# EAGLE design Adapter Custom (EAGLE 8.2.2)
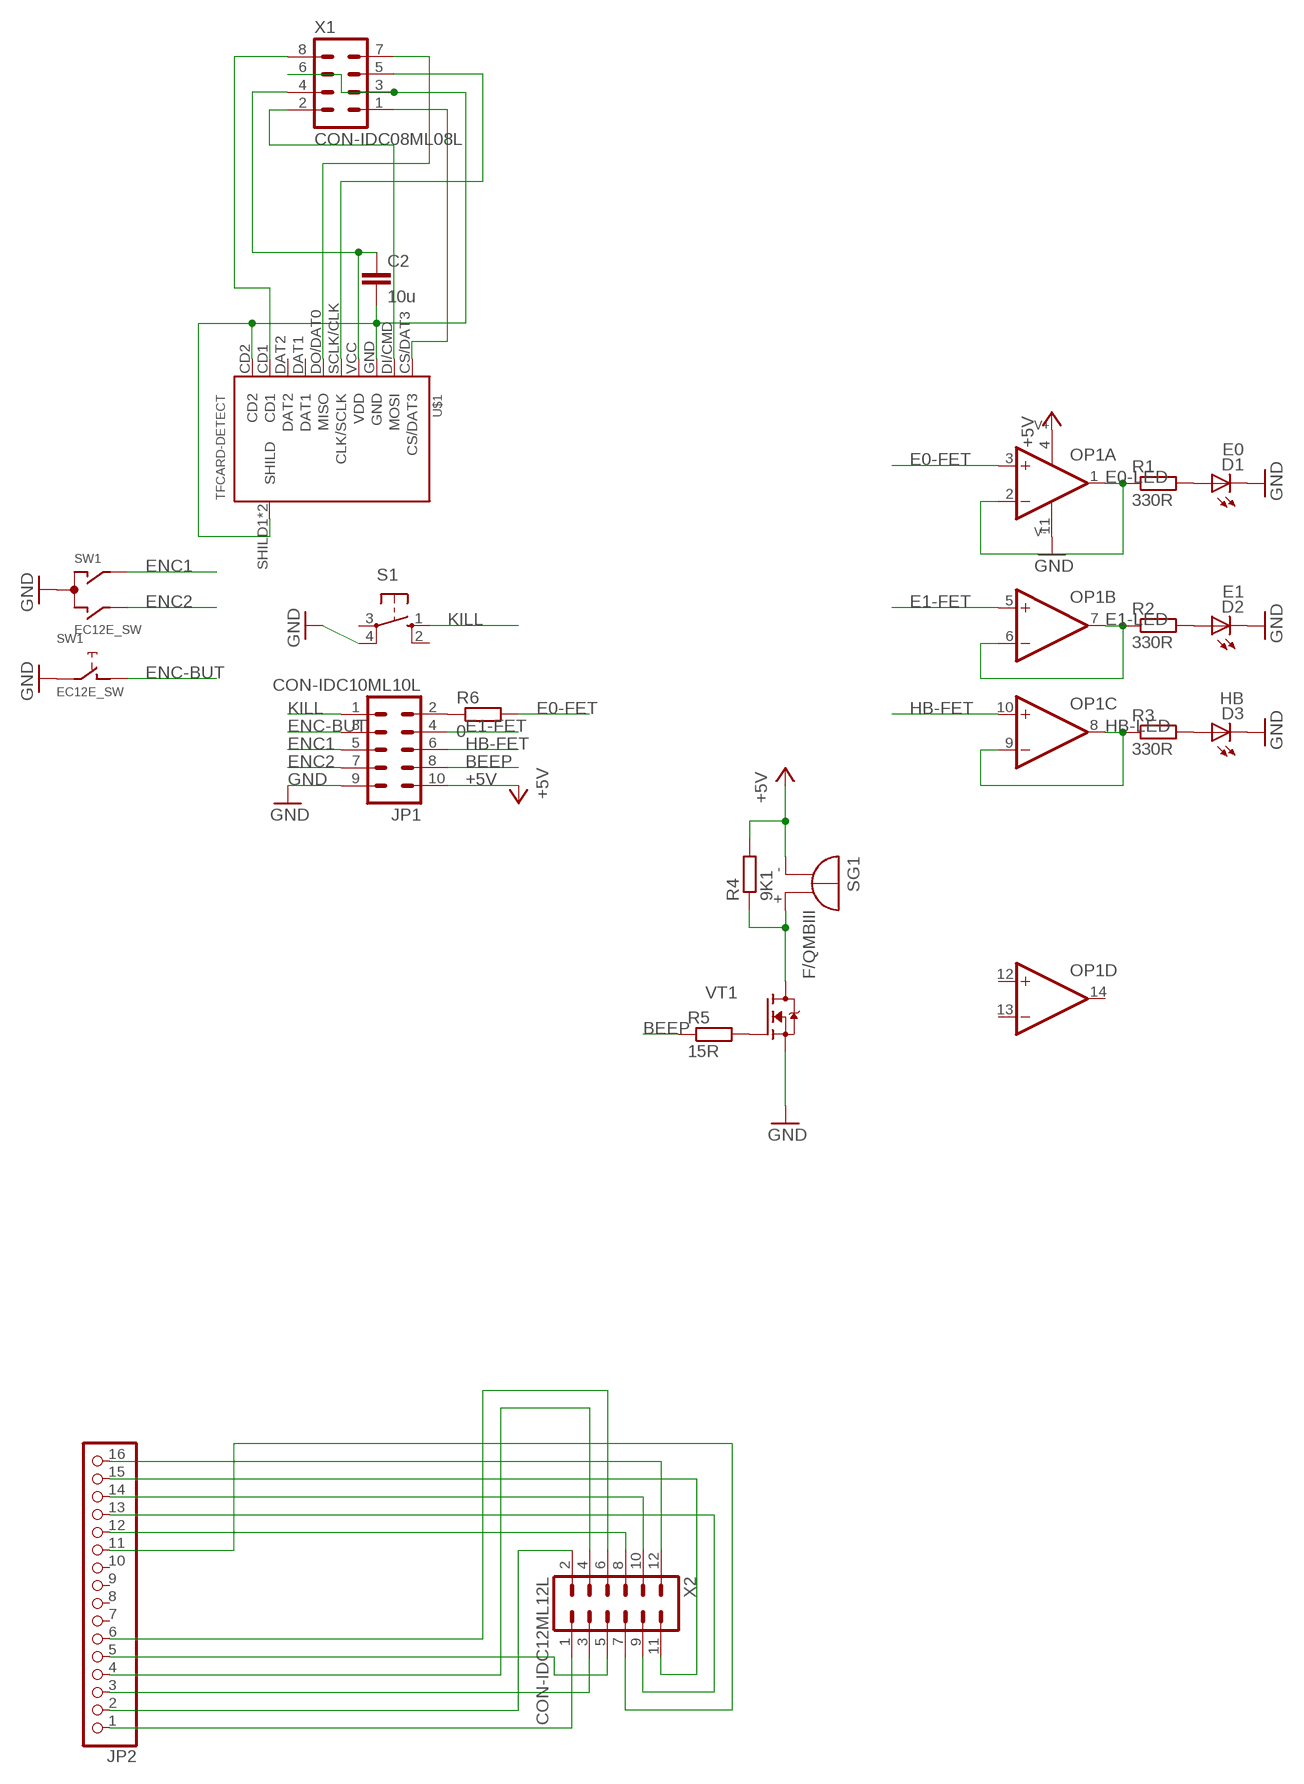
[diagram p0: schematic, sheet 1]

## Parts
C2  10u  CAP_0805  [C0805]
D1  E0  LED_3MM  [LED3MM]
D2  E1  LED_3MM  [LED3MM]
D3  HB  LED_3MM  [LED3MM]
JP1  CON-IDC10ML10L  [ML10L]
JP2  PINHD-1X16  [1X16]
OP1  OP-AMP-4LMV324IPT  [TSSOP14]
R1  330R  R_0805  [R0805]
R2  330R  R_0805  [R0805]
R3  330R  R_0805  [R0805]
R4  9K1  R_0805  [R0805]
R5  15R  R_0805  [R0805]
R6  0  R_0805  [R0805]
S1  40-XX  [B3F-40XX]
SG1  F/QMBIII  [F/QMBIII]
SW1  EC12E_SW  [ALPS_EC12E_SW]
U$1  TFCARD-DETECT  [ST-TF-DETECT]
VT1  FET-NSOT-23  [SOT23]
X1  CON-IDC08ML08L  [ML08L]
X2  CON-IDC12ML12L  [ML12L]

## Nets
+5V: JP1.10 OP1.4(PW:V+) R4.2 SG1.-(+)
BEEP: JP1.8 R5.1
E0-FET: OP1.3(A:+IN) R6.2
E0-LED: OP1.1(A:OUT) OP1.2(A:-IN) R1.1
E1-FET: JP1.4 OP1.5(B:+IN)
E1-LED: OP1.6(B:-IN) OP1.7(B:OUT) R2.1
ENC1: JP1.5 SW1.A
ENC2: JP1.7 SW1.B
ENC-BUT: JP1.3 SW1.D
GND: D1.K(C) D2.K(C) D3.K(C) JP1.9 OP1.11(PW:V-) S1.4(P1) SW1.C SW1.E VT1.2(S)
HB-FET: JP1.6 OP1.10(C:+IN)
HB-LED: OP1.8(C:OUT) OP1.9(C:-IN) R3.1
KILL: JP1.1 S1.1(S)
N$2: D1.A R1.2
N$3: D2.A R2.2
N$4: D3.A R3.2
N$5: R5.2 VT1.1(G)
N$6: R4.1 SG1.+(-) VT1.3(D)
N$7: JP1.2 R6.1
N$8: C2.2 U$1.CD2 U$1.GND U$1.SHILD1(SHILD) U$1.SHILD2(SHILD) X1.3 X1.6
N$9: C2.1 U$1.VCC(VDD) X1.4
N$10: U$1.CS/DAT3 X1.1
N$11: U$1.DI/CMD(MOSI) X1.2
N$12: JP2.16 X2.12
N$13: JP2.15 X2.11
N$14: U$1.SCLK/CLK(CLK/SCLK) X1.5
N$15: JP2.14 X2.10
N$16: U$1.DO/DAT0(MISO) X1.7
N$17: JP2.12 X2.8
N$18: JP2.13 X2.9
N$19: JP2.11 X2.7
N$20: JP2.1 X2.1
N$21: JP2.2 X2.2
N$22: JP2.3 X2.3
N$23: JP2.5 X2.5
N$24: JP2.4 X2.4
N$25: JP2.6 X2.6
N$27: U$1.CD1 X1.8
Unconnected: JP2.7 JP2.8 JP2.9 JP2.10 OP1.12(D:+IN) OP1.13(D:-IN) OP1.14(D:OUT) S1.2(S1) S1.3(P) SW1.GND1(G) SW1.GND2(G) U$1.DAT1 U$1.DAT2

## Library data of the parts
C2 = Namenlos:CAP_
D1-D3 = Namenlos:LED_
JP1 = Namenlos:CON-IDC10: HARTING; OC_FARNELL: unknown; OC_NEWARK: unknown
JP2 = pinhead:PINHD-1X16: PIN HEADER
OP1 = Namenlos:OP-AMP-4
R1-R6 = Namenlos:R_
S1 = switch-omron:40-XX: OMRON SWITCH; MF: OMRON COMPONENTS USA; MPN: B3F-4000; OC_FARNELL: 176434; OC_NEWARK: 36K3105
SG1 = buzzer:F/QMBIII: BUZZER Source: Buerklin; OC_FARNELL: unknown; OC_NEWARK: unknown
SW1 = switch-alps:EC12E_SW: ALPS rotary Encoder EC12E series with switch; MPN: EC12E2424407; OC_FARNELL: 1520813; OC_NEWARK: 74M1068
U$1 = Namenlos:TFCARD-DETECT
VT1 = Namenlos:FET-N
X1 = Namenlos:CON-IDC08
X2 = Namenlos:CON-IDC12

## Board
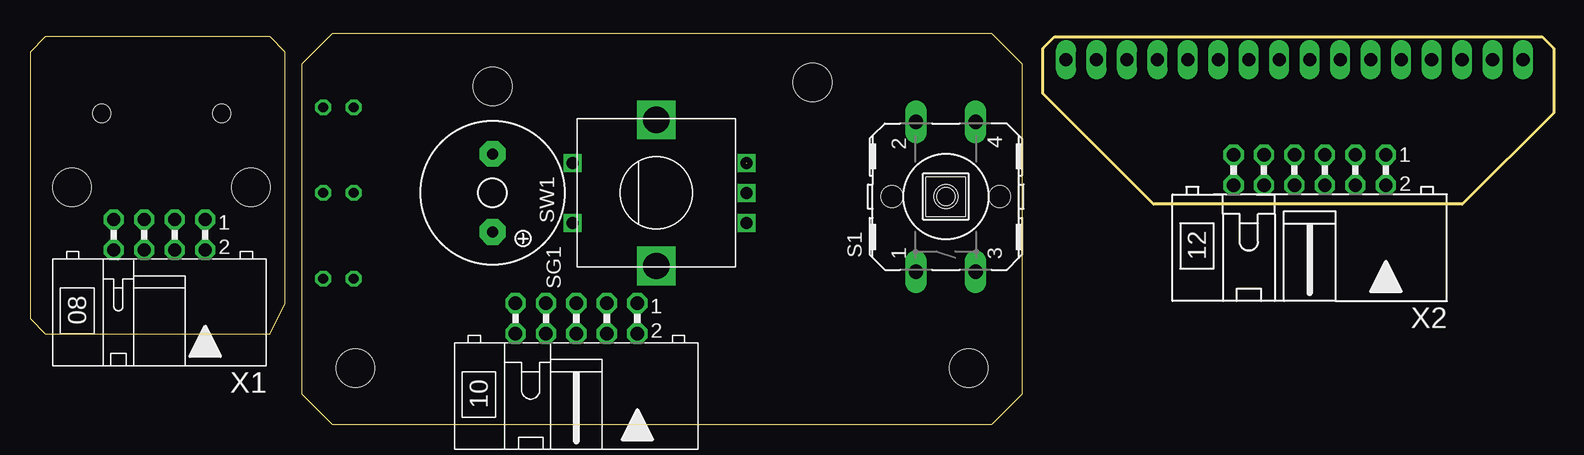
[diagram p1: board, top side]
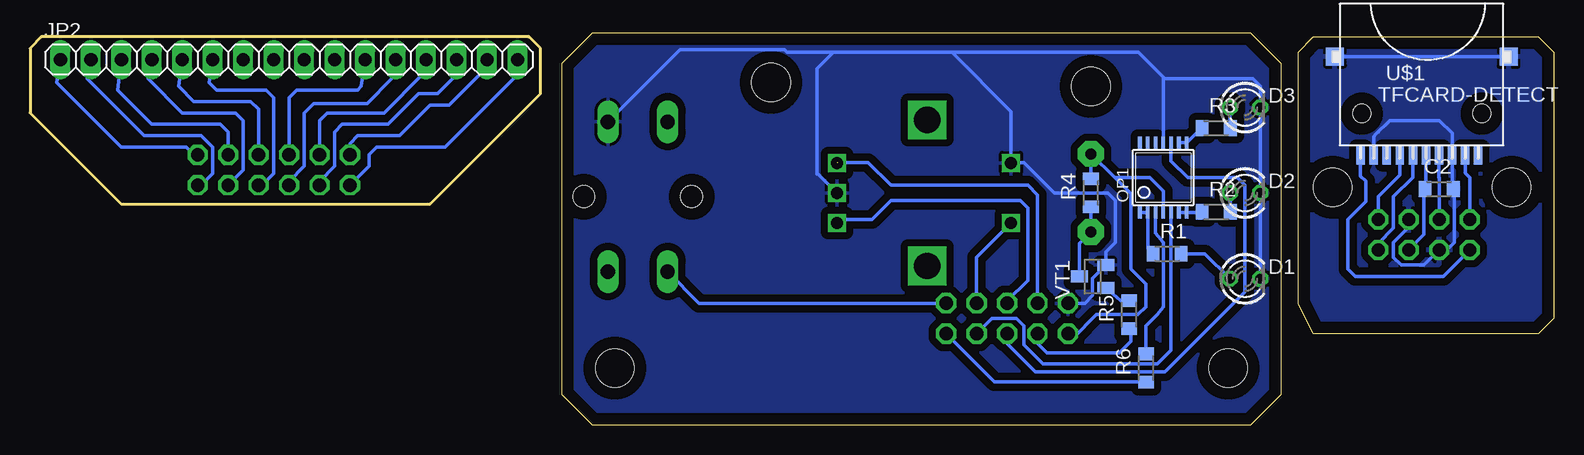
[diagram p2: board, bottom side, seen from below]

Size 127 x 32.7 mm. Coordinates in mm from the lower left corner, seen from the top.
Outline: 1.27,7.62 20,7.62 21.27,10.16 21.27,31.11 20,32.38 1.27,32.38 0,31.11 0,8.89 1.27,7.62
Outline: 25.22,0 22.68,2.54 22.68,30.16 25.22,32.7 80.15,32.7 82.69,30.16 82.69,2.54 80.15,0 25.22,0
Outline: 85.41,32.38 126.05,32.38 127,31.43 127,26.04 119.38,18.42 93.66,18.42 84.46,27.62 84.46,31.43 85.41,32.38
Copper layers (1*16): Top 0.035mm / dielectric 1.5mm / Bottom 0.035mm
Design rules "EagleDesignRules": minimum track width 0.2mm, minimum drill 0.3mm, track to track 0.2mm, track to pad 0.2mm, pad to pad 0.2mm, via to via 0.2mm, smd to smd 0.2mm, copper to edge 1mm, drill to drill 0.2mm, minimum pad ring 10mil, minimum via ring 8mil, stop-mask expansion 4mil, vias tented up to drill 0mil, thermal gap 0.25mm
Holes 3.2 mm at 3.49,19.84 27.13,4.76 78.25,4.76 65.23,28.58 38.56,28.26 18.41,19.84

### Footprints (pad centres in the part's own frame; a part is rotated, then mirrored left to right if it is on the bottom)
C0805 = smd 1.05 x 1.3: 1 -1.175,0; 2 1.175,0
LED3MM = drill 0.813 octagon: A -1.27,0; K 1.27,0
ML10L = drill 1.1 pad 1.676 octagon: 1 -5.08,-1.27; 2 -5.08,1.27; 3 -2.54,-1.27; 4 -2.54,1.27; 5 0,-1.27; 6 0,1.27; 7 2.54,-1.27; 8 2.54,1.27; 9 5.08,-1.27; 10 5.08,1.27
1X16 = drill 1.1 long: 1 -19.05,0; 2 -16.51,0; 3 -13.97,0; 4 -11.43,0; 5 -8.89,0; 6 -6.35,0; 7 -3.81,0; 8 -1.27,0; 9 1.27,0; 10 3.81,0; 11 6.35,0; 12 8.89,0; 13 11.43,0; 14 13.97,0; 15 16.51,0; 16 19.05,0
TSSOP14 = smd 0.305 x 0.991: 1 -1.95,-2.918; 2 -1.3,-2.918; 3 -0.65,-2.918; 4 0,-2.918; 5 0.65,-2.918; 6 1.3,-2.918; 7 1.95,-2.918; 8 1.95,2.918; 9 1.3,2.918; 10 0.65,2.918; 11 0,2.918; 12 -0.65,2.918; 13 -1.3,2.918; 14 -1.95,2.918
R0805 = smd 1.05 x 1.3: 1 -1.175,0; 2 1.175,0
B3F-40XX = drill 1.194 long: 1 -6.248,2.489; 2 6.248,2.489; 3 -6.248,-2.489; 4 6.248,-2.489 | hole 1.803: 0,-4.496; 0,4.496
F/QMBIII = drill 0.914 pad 2.159 octagon: + 3.251,0; - -3.251,0
ALPS_EC12E_SW = drill 1 square: A -2.5,-7.5; B 2.5,-7.5; C 0,-7.5; D -2.5,7; E 2.5,7 | drill 2.2 square: GND1 -6.1,0; GND2 6.1,0
ST-TF-DETECT = smd 0.7 x 1.5: CD1 -5.29,-2.91; CD2 -4.2,-2.91; CS/DAT3 -2.02,-2.91; DAT1 4.52,-2.91; DAT2 -3.11,-2.91; DI/CMD -0.93,-2.91; DO/DAT0 3.43,-2.91; GND 2.34,-2.91; SCLK/CLK 1.25,-2.91; VCC 0.16,-2.91 | smd 1.5 x 1.5: SHILD1 -7.43,5.34; SHILD2 7.06,5.32 | hole 1.5: -5.18,0.59; 4.82,0.59
SOT23 = smd 1 x 1.4: 1 -0.95,-1.1; 2 0.95,-1.1; 3 0,1.1
ML08L = drill 1.1 pad 1.676 octagon: 1 -3.81,-1.27; 2 -3.81,1.27; 3 -1.27,-1.27; 4 -1.27,1.27; 5 1.27,-1.27; 6 1.27,1.27; 7 3.81,-1.27; 8 3.81,1.27
ML12L = drill 1.1 pad 1.676 octagon: 1 -6.35,-1.27; 2 -6.35,1.27; 3 -3.81,-1.27; 4 -3.81,1.27; 5 -1.27,-1.27; 6 -1.27,1.27; 7 1.27,-1.27; 8 1.27,1.27; 9 3.81,-1.27; 10 3.81,1.27; 11 6.35,-1.27; 12 6.35,1.27

### Placement (x,y rotation side)
C2  9.52,19.69 0 bottom
D1  25.72,12.21 0 bottom
D2  25.72,19.37 0 bottom
D3  25.72,26.49 0 bottom
JP1  45.55,8.89 180 top
JP2  105.41,30.48 0 bottom
OP1  32.53,20.64 0 bottom
R1  32.2,14.29 0 bottom
R2  28.11,17.78 0 bottom
R3  28.11,24.77 0 bottom
R4  38.56,19.37 90 bottom
R5  35.39,9.21 90 bottom
R6  33.97,4.76 90 bottom
S1  76.34,19.05 90 top
SG1  38.56,19.37 270 top
SW1  52.21,19.37 90 top
U$1  10.79,25.4 0 bottom
VT1  38.42,12.38 90 bottom
X1  10.79,15.88 180 top
X2  106.68,21.27 180 top

### Tracks (layer width: path | path; a pad name or v marks a point on that pad's centre or on a via)
+5V
  Bottom 0.305: JP1.10 39.69,7.62 38.42,8.89 38.1,9.21 34.63,9.21 33.97,9.87 33.97,11.75 35.24,13.02 35.24,19.3 36.58,20.64 | R4.2 SG1.- 36.58,20.64 | OP1.4 32.53,19.51 33.65,20.64 36.58,20.64
BEEP
  Bottom 0.305: JP1.8 43,6.81 42.23,6.03 36.19,6.03 35.24,6.98 35.24,7.89 R5.1
E0-FET
  Bottom 0.305: OP1.3 33.18,16.03 32.5,15.24 32.5,9.84 33.02,9.21 33.97,8.26 R6.2
E0-LED
  Bottom 0.305: OP1.1 OP1.2 33.83,14.74 R1.1
E1-FET
  Bottom 0.305: JP1.4 46.82,8.89 44.77,8.89 44.13,8.26 44.13,6.67 42.54,5.08 33.02,5.08 31.88,6.22 31.88,13.46 31.91,13.49 31.91,15.08 31.88,15.11 OP1.5
E1-LED
  Bottom 0.305: R2.1 29.35,17.72 OP1.7 OP1.6
ENC1
  Bottom 0.305: JP1.5 45.54,10.34 43.82,12.07 43.82,18.1 44.45,18.73 55.25,18.73 56.83,17.14 59.44,17.14 SW1.A
ENC2  (1 unrouted)
  Bottom 0.305: 59.75,21.91 SW1.B | JP1.7 43,19.19 43.82,20 55.25,20 57.15,21.91 59.69,21.91
ENC-BUT
  Bottom 0.305: JP1.3 48.08,13.99 SW1.D
GND
  Bottom 0.305: 60.01,31.11 50.17,31.11 45.21,26.16 SW1.E 45.17,21.91 44.13,21.91 41.59,19.37 37.15,19.37 36.51,18.73 36.51,15.24 37.32,14.44 VT1.2 38.42,12.23 38.42,10.8 39.05,10.16 JP1.9 | 60.01,31.11 63.88,31.11 64.09,31.33 72.8,31.33 S1.4 | 60.01,31.11 61.41,29.72 61.41,20.95 61.29,20.95 SW1.C | 50.8,31.11 34.61,31.11 33.15,29.65 | 33.15,29.65 33.02,29.53 | OP1.11 32.53,28.89 32.53,29.04 32.67,29.18 | 32.67,29.18 33.15,29.65 | 32.67,29.18 32.39,28.89 25.08,28.89 24.45,28.26 D3.K D2.K D1.K
  pour Bottom (isolate 0.61): 22.86,30.16 25.4,32.7 80.01,32.7 82.87,29.84 82.87,2.54 80.33,0 25.08,0 22.86,2.22
HB-FET
  Bottom 0.305: OP1.10 31.88,22.03 30.48,20.64 26.35,20.64 25.72,20 25.72,11.11 32.39,4.45 43.18,4.45 45.54,6.81 JP1.6
HB-LED
  Bottom 0.305: R3.1 29.37,24.76 OP1.8 OP1.9
KILL
  Bottom 0.305: JP1.1 71.21,10.16 S1.1
N$2
  Bottom 0.305: D1.A 29.07,14.29 R1.2
N$3
  Bottom 0.305: D2.A 26.94,19.32 R2.2
N$4
  Bottom 0.305: R3.2 26.99,24.81 D3.A
N$5
  Bottom 0.305: R5.2 36.09,10.38 VT1.1
N$6
  Bottom 0.305: R4.1 SG1.+ 39.52,15.16 VT1.3
N$7
  Bottom 0.305: JP1.2 46.59,3.59 R6.1
N$8
  Bottom 0.305: 8.25,19.99 8.25,20 | 8.25,19.99 8.25,15.24 8.89,14.61 X1.6 10.79,13.33 12.7,13.33 13.34,13.97 13.34,15.24 12.07,16.51 X1.3 | 8.25,19.99 8.26,19.37 C2.2 8.46,20.11 U$1.GND 8.46,24.33 9.52,25.4 13.65,25.4 14.8,24.25 | U$1.SHILD2 3.75,30.74 U$1.SHILD1 | 14.8,24.25 14.61,24.45 | 14.8,24.25 15,24.06 U$1.CD2
  pour Bottom (isolate 0.61): 0,31.12 0,8.89 1.27,7.62 20,7.94 21.27,10.48 21.27,31.12 20,32.38 1.27,32.38
N$9
  Bottom 0.305: X1.4 10.79,15.87 10.79,19.69 | 10.79,20.01 10.79,19.69 | 10.79,20.01 10.79,19.69 | 10.79,20.01 10.78,20 C2.1 10.63,19.75 U$1.VCC
N$10
  Bottom 0.305: X1.1 14.61,19.05 13.97,19.69 13.02,20.64 12.82,20.84 U$1.CS/DAT3
N$11
  Bottom 0.305: X1.2 14.61,15.16 13.34,16.43 13.34,19.05 11.72,20.66 U$1.DI/CMD
N$12
  Bottom 0.305: JP2.16 86.68,28.89 92.39,23.18 98.11,23.18 98.74,22.54 98.74,21.59 X2.12
N$13
  Bottom 0.305: JP2.15 89.22,29.53 92.08,26.67 93.66,26.67 96.2,24.13 99.69,24.13 100.33,23.49 X2.11
N$14
  Bottom 0.305: X1.5 9.52,20.64 9.54,20.66 U$1.SCLK/CLK
N$15
  Bottom 0.305: X2.10 102.87,20.32 101.6,21.59 101.6,24.45 100.96,25.08 97.16,25.08 94.61,27.62 93.03,27.62 91.76,28.89 JP2.14
N$16
  Bottom 0.305: X1.7 6.98,20.64 7.37,21.02 U$1.DO/DAT0
N$17
  Bottom 0.305: X2.8 105.41,20.32 104.14,21.59 104.14,26.04 103.35,26.83 98.9,26.83 96.84,28.89 JP2.12
N$18
  Bottom 0.305: JP2.13 94.3,29.21 97.47,26.04 102.24,26.04 102.87,25.4 X2.9
N$19
  Bottom 0.305: JP2.11 99.38,28.26 99.69,27.94 104.77,27.94 105.41,27.31 X2.7
N$20
  Bottom 0.305: JP2.1 124.78,28.58 119.38,23.18 113.98,23.18 113.03,22.22 X2.1
N$21
  Bottom 0.305: X2.2 112.71,20 111.76,20.95 111.76,23.18 112.71,24.13 117.47,24.13 122.24,28.89 JP2.2
N$22
  Bottom 0.305: JP2.3 119.7,27.94 116.84,25.08 111.13,25.08 110.49,24.45 X2.3
N$23
  Bottom 0.305: JP2.5 114.62,28.26 113.35,26.99 108.58,26.99 107.95,26.35 X2.5
N$24
  Bottom 0.305: X2.4 109.22,21.27 109.22,25.4 109.85,26.04 114.3,26.04 117.16,28.89 JP2.4
N$25
  Bottom 0.305: X2.6 107.63,20 106.68,20.95 106.68,27.31 107.32,27.94 111.44,27.94 112.08,28.58 JP2.6
N$27
  Bottom 0.305: U$1.CD1 16.09,20.77 15.66,20.35 15.66,18.63 17.14,17.14 17.14,13.02 16.51,12.38 9.21,12.38 X1.8